# EAGLE design piskac (EAGLE 7.2.0)
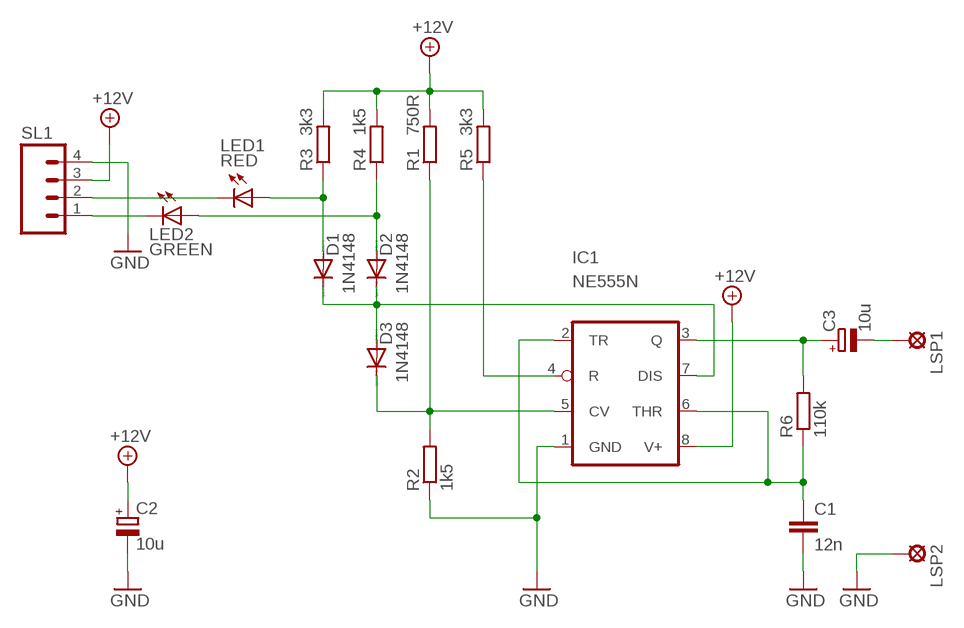
[diagram p0: schematic, sheet 1]

## Parts
C1  12n  C5/3.5  [C5B3.5]
C2  10u  CPOL-EUE2.5-6  [E2,5-6]
C3  10u  CPOL-EUE2.5-6  [E2,5-6]
D1  1N4148  DIODE-DO35-10  [DO35-10]
D2  1N4148  DIODE-DO35-10  [DO35-10]
D3  1N4148  DIODE-DO35-10  [DO35-10]
IC1  NE555N  [DIL08]
LED1  RED  LED3MM  [LED3MM]
LED2  GREEN  LED3MM  [LED3MM]
LSP1  LSP10  [LSP10]
LSP2  LSP10  [LSP10]
R1  750R  R-EU_0207/10  [0207/10]
R2  1k5  R-EU_0207/10  [0207/10]
R3  3k3  R-EU_0207/10  [0207/10]
R4  1k5  R-EU_0207/10  [0207/10]
R5  3k3  R-EU_0207/10  [0207/10]
R6  110k  R-EU_0207/10  [0207/10]
SL1  M04  [04P]

## Nets
+12V: C2.+ IC1.8(V+) R1.2 R3.2 R4.2 R5.2 SL1.3
GND: C1.2 C2.- IC1.1(GND) LSP2.MP R2.1 SL1.4
N$1: C1.1 IC1.2(TR) IC1.6(THR) R6.1
N$2: D3.C IC1.5(CV) R1.1 R2.2
N$3: C3.- LSP1.MP
N$4: IC1.4(R) R5.1
N$5: D1.A LED1.A R3.1
N$6: LED1.K(C) SL1.2
N$7: D2.A LED2.A R4.1
N$8: C3.+ IC1.3(Q) R6.2
N$9: D1.C D2.C D3.A IC1.7(DIS)
N$11: LED2.K(C) SL1.1

## Library data of the parts
C1 = capacitor-wima:C: CAPACITOR naming: grid - package width
C2 C3 = rcl:CPOL-EU: POLARIZED CAPACITOR, European symbol
D1-D3 = diode:DIODE-: DIODE
IC1 = linear:*555: TIMER
LED1 LED2 = led:LED: LED OSRAM: - CHIPLED LG R971, LG N971, LY N971, LG Q971, LY Q971, LO R971, LY R971 LH N974, LH R974 LS Q976, LO Q976, LY Q976 LO Q996 - Hyper CHIPLED LW Q18S LB Q993, LB Q99A, LB R99A - SideLED LS A670, LO A670, LY A670, LG A670, LP A670 LB A673, LV A673, LT A673, LW A673 LH A674 LY A675 LS A676, LA A676, LO A676, LY A676, LW A676 LS A679, LY A679, LG A679 - Hyper Micro SIDELED® LS Y876, LA Y876, LO Y876, LY Y876 LT Y87S - SmartLED LW L88C, LW L88S LB L89C, LB L89S, LG L890 LS L89K, LO L89K, LY L89K LS L896, LA L896, LO L896, LY L896 - TOPLED LS T670, LO T670, LY T670, LG T670, LP T670 LSG T670, LSP T670, LSY T670, LOP T670, LYG T670 LG T671, LOG T671, LSG T671 LB T673, LV T673, LT T673, LW T673 LH T674 LS T676, LA T676, LO T676, LY T676, LB T676, LH T676, LSB T676, LW T676 LB T67C, LV T67C, LT T67C, LS T67K, LO T67K, LY T67K, LW E67C LS E67B, LA E67B, LO E67B, LY E67B, LB E67C, LV E67C, LT E67C LW T67C LS T679, LY T679, LG T679 LS T770, LO T770, LY T770, LG T770, LP T770 LB T773, LV T773, LT T773, LW T773 LH T774 LS E675, LA E675, LY E675, LS T675 LS T776, LA T776, LO T776, LY T776, LB T776 LHGB T686 LT T68C, LB T68C - Hyper Mini TOPLED® LB M676 - Mini TOPLED Santana® LG M470 LS M47K, LO M47K, LY M47K Source: http://www.osram.convergy.de LUXEON: - LUMILED® LXK2-PW12-R00, LXK2-PW12-S00, LXK2-PW14-U00, LXK2-PW14-V00 LXK2-PM12-R00, LXK2-PM12-S00, LXK2-PM14-U00 LXK2-PE12-Q00, LXK2-PE12-R00, LXK2-PE12-S00, LXK2-PE14-T00, LXK2-PE14-U00 LXK2-PB12-K00, LXK2-PB12-L00, LXK2-PB12-M00, LXK2-PB14-N00, LXK2-PB14-P00, LXK2-PB14-Q00 LXK2-PR12-L00, LXK2-PR12-M00, LXK2-PR14-Q00, LXK2-PR14-R00 LXK2-PD12-Q00, LXK2-PD12-R00, LXK2-PD12-S00 LXK2-PH12-R00, LXK2-PH12-S00 LXK2-PL12-P00, LXK2-PL12-Q00, LXK2-PL12-R00 Source: www.luxeon.com KINGBRIGHT: KA-3528ASYC Source: www.kingbright.com
LSP1 LSP2 = solpad:LSP10: SOLDER PAD drill 1.0 mm, distributor Buerklin, 12H555
R1-R6 = rcl:R-EU_: RESISTOR, European symbol
SL1 = con-amp-quick:M04: AMP QUICK CONNECTOR; OC_FARNELL: unknown; OC_NEWARK: unknown

## Board
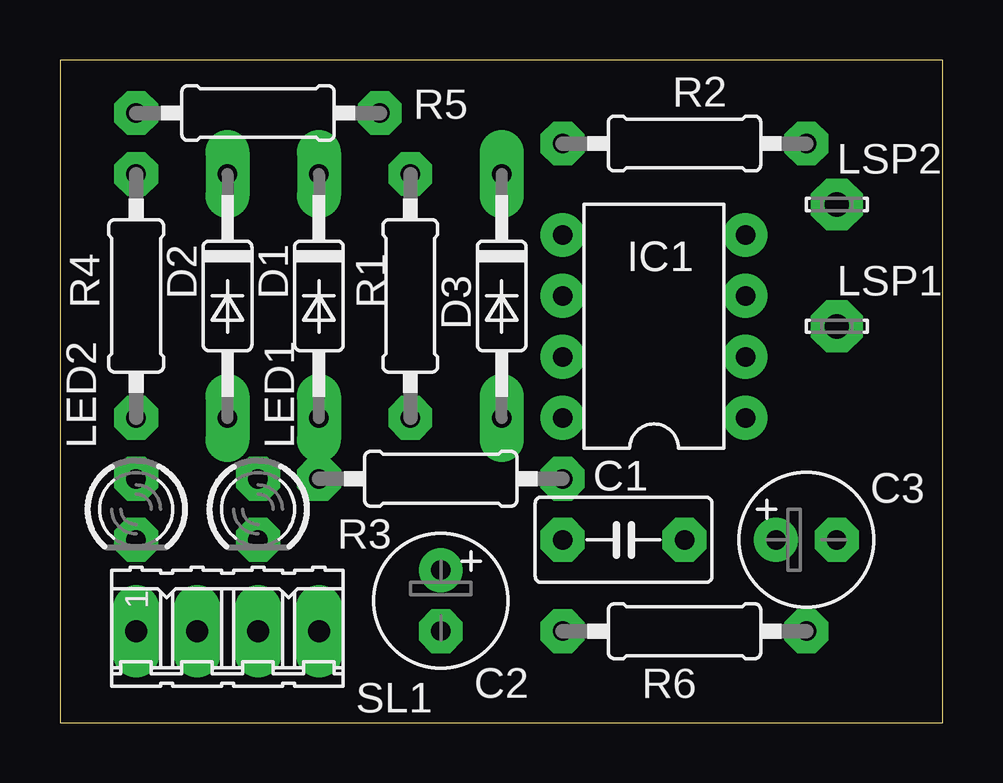
[diagram p1: board, top side]
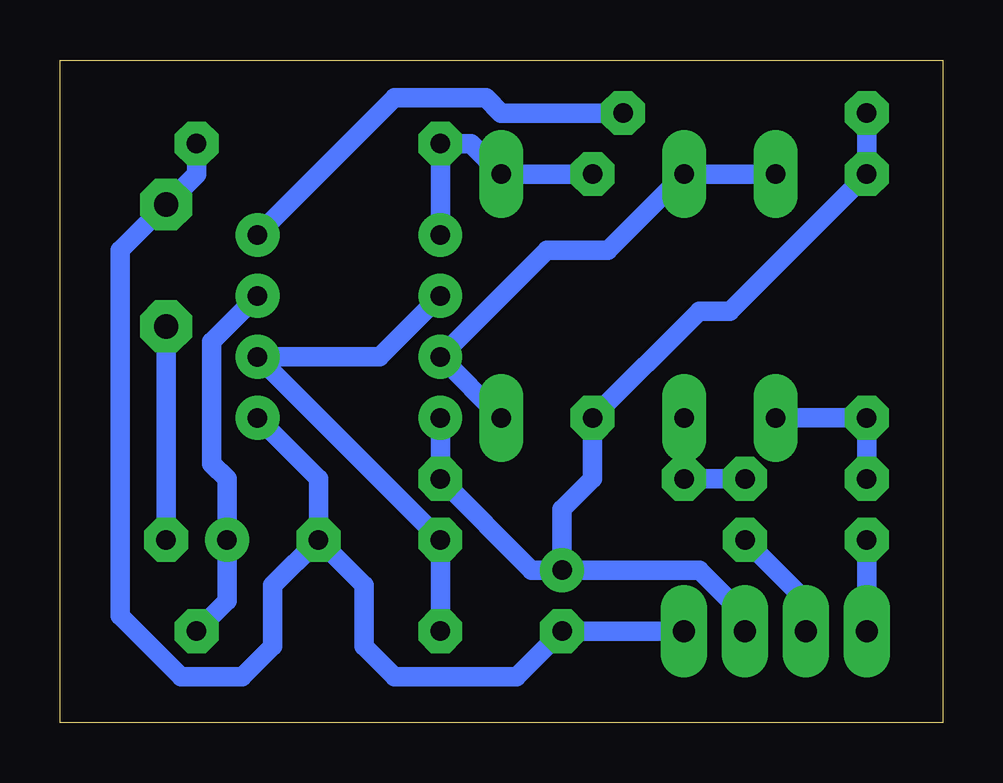
[diagram p2: board, bottom side, seen from below]

Size 36.81 x 27.61 mm. Coordinates in mm from the lower left corner, seen from the top.
Outline: 0,0 36.81,0 36.81,27.61 0,27.61 0,0
Copper layers (1*16): Top 0.035mm / dielectric 1.5mm / Bottom 0.035mm
Design rules "designRules": minimum track width 10mil, minimum drill 24mil, track to track 8mil, track to pad 8mil, pad to pad 8mil, via to via 8mil, smd to smd 8mil, copper to edge 20mil, drill to drill 8mil, minimum pad ring 20mil, minimum via ring 8mil, stop-mask expansion 4mil, vias tented up to drill 0mil, thermal gap 10mil

### Footprints (pad centres in the part's own frame; a part is rotated, then mirrored left to right if it is on the bottom)
C5B3.5 = drill 0.813 pad 1.6 octagon: 1 -2.54,0; 2 2.54,0
E2,5-6 = drill 0.813 pad 1.6: + -1.27,0 | drill 0.813 pad 1.6 octagon: - 1.27,0
DO35-10 = drill 0.813 long: A 5.08,0; C -5.08,0
DIL08 = drill 0.813 pad 1.27: 1 -3.81,-3.81; 2 -1.27,-3.81; 3 1.27,-3.81; 4 3.81,-3.81; 5 3.81,3.81; 6 1.27,3.81; 7 -1.27,3.81; 8 -3.81,3.81
LED3MM = drill 0.813 octagon: A -1.27,0; K 1.27,0
LSP10 = drill 1.016 pad 2.159 octagon: MP 0,0
0207/10 = drill 0.813 octagon: 1 -5.08,0; 2 5.08,0
04P = drill 0.914 long: 1 -3.81,0; 2 -1.27,0; 3 1.27,0; 4 3.81,0

### Placement (x,y rotation side)
C1  23.5,7.62 0 top
C2  15.88,5.08 270 top
C3  31.11,7.62 0 top
D1  10.79,17.78 270 top
D2  6.99,17.78 270 top
D3  18.41,17.78 270 top
IC1  24.77,16.51 90 top
LED1  8.26,8.89 270 top
LED2  3.17,8.89 270 top
LSP1  32.38,16.51 0 top
LSP2  32.38,21.59 0 top
R1  14.61,17.78 270 top
R2  26.04,24.13 180 top
R3  15.88,10.16 0 top
R4  3.17,17.78 90 top
R5  8.26,25.4 180 top
R6  26.04,3.81 0 top
SL1  6.99,3.81 0 top

### Tracks (layer width: path | path; a pad name or v marks a point on that pad's centre or on a via)
+12V
  Bottom 0.813: C2.+ 15.88,8.89 14.61,10.16 R1.2 10.16,17.14 8.89,17.14 R4.2 R5.2 | C2.+ 10.16,6.35 8.26,4.45 SL1.3 | IC1.8 R3.2 17.14,6.35 C2.+
GND
  Bottom 0.813: SL1.4 C2.- 17.78,1.91 22.86,1.91 24.13,3.17 24.13,5.71 C1.2 | C1.2 26.04,10.16 IC1.1 | R2.1 31.11,22.86 LSP2.MP 34.29,19.68 34.29,4.45 31.75,1.91 29.21,1.91 27.94,3.17 27.94,5.71 C1.2
N$1
  Bottom 0.813: IC1.6 23.5,15.24 IC1.2 C1.1 R6.1
N$2
  Bottom 0.813: IC1.5 R2.2 19.68,24.13 D3.C R1.1
N$3
  Bottom 0.813: C3.- LSP1.MP
N$4
  Bottom 0.813: IC1.4 22.86,26.04 19.05,26.04 18.41,25.4 R5.1
N$5
  Bottom 0.813: LED1.A R3.1 D1.A
N$6
  Bottom 0.813: SL1.2 5.71,5.08 LED1.K
N$7
  Bottom 0.813: D2.A R4.1 LED2.A
N$8
  Bottom 0.813: R6.2 29.84,5.08 C3.+ 29.84,10.16 30.48,10.79 30.48,15.88 IC1.3
N$9
  Bottom 0.813: D2.C D1.C 13.97,19.68 16.51,19.68 IC1.7 D3.A
N$11
  Bottom 0.813: SL1.1 LED2.K